# Altium schematic sheet RS232.SchDoc
size 297 x 209 mm; SheetNumber: 3; SheetTotal: 12
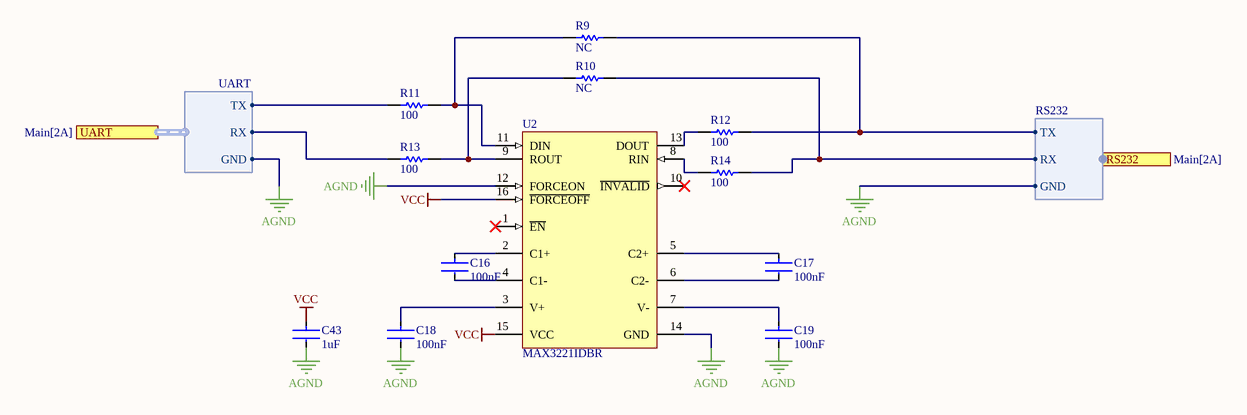
[diagram p0: RS232.SchDoc]

## Parts
C16  100nF  [CAP-0603]
C17  100nF  [CAP-0603]
C18  100nF  [CAP-0603]
C19  100nF  [CAP-0603]
C43  1uF  [CAP-0603]
R9  NC  [RES-0603]
R10  NC  [RES-0603]
R11  100  [RES-0603]
R12  100  [RES-0603]
R13  100  [RES-0603]
R14  100  [RES-0603]
U2  MAX3221IDBR  [DB0016A_M]

## Ports
RS232 (harness RS232, see Main[2A]), UART (harness UART, see Main[2A])

## Harnesses
UART: TX, RX, GND
RS232: TX, RX, GND

## Nets
AGND: C18.2 C19.2 C43.2 U2.12(FORCEON) U2.14(GND) ; port UART.GND, port RS232.GND
VCC: C43.1 U2.15(VCC) U2.16(~{FORCEOFF})
NetC16_1: C16.1 U2.2(C1+)
NetC16_2: C16.2 U2.4(C1-)
NetC17_1: C17.1 U2.5(C2+)
NetC17_2: C17.2 U2.6(C2-)
NetC18_1: C18.1 U2.3(V+)
NetC19_1: C19.1 U2.7(V-)
NetR9_1: R9.1 R11.2 U2.11(DIN)
NetR9_2: R9.2 R12.2 ; port RS232.TX
NetR10_1: R10.1 R13.2 U2.9(ROUT)
NetR10_2: R10.2 R14.2 ; port RS232.RX
NetR11_1: R11.1 ; port UART.TX
NetR12_1: R12.1 U2.13(DOUT)
NetR13_1: R13.1 ; port UART.RX
NetR14_1: R14.1 U2.8(RIN)

Not connected (* = marked no-connect by the designer): U2 1(~{EN})* 10(~{INVALID})*

## Notes on the sheet
- Title
- Size:
- Date:
- A4
- Variant :
- Time:
- Sheet
- Revision:
- of
- Company Link :
- Designer:
- Designer Link:
- www.fatehscan.com
- File:

## Library data of the parts
C16-C19 = CAP-Ceramic: Chip Multilayer Ceramic Capacitors for General Purpose, 0603; Voltage Rating (DC): 6.3V; Dielectric: X5R; Tolerance: 20%; Packaging: Tape and Reel; Width: 0.031inch; Termination: SMD/SMT; Package Quantity: 4000; Voltage Rating: 6.3V; Capacitance: 100nF; Case/Package: 0603; Min Operating Temperature: -55°C; Voltage: 6.3V; Length: 1.6mm; Thickness: 0.035inch; Lead Free: Lead Free; Depth: 0.8mm; Case Code (Imperial): 0603; Max Operating Temperature: 85°C; Material: Ceramic; Height: 0.8mm; Mount: Surface Mount; REACH SVHC: No SVHC; Radiation Hardening: No; Case Code (Metric): 1608
C43 = CAP-Ceramic: Chip Multilayer Ceramic Capacitors for General Purpose, 0603; Voltage Rating (DC): 6.3V; Dielectric: X5R; Capacitance: 100nF; Tolerance: 20%; Packaging: Tape and Reel; Width: 0.031inch; Termination: SMD/SMT; Package Quantity: 4000; Voltage Rating: 6.3V; Case/Package: 0603; Min Operating Temperature: -55°C; Voltage: 6.3V; Length: 1.6mm; Thickness: 0.035inch; Lead Free: Lead Free; Depth: 0.8mm; Case Code (Imperial): 0603; Max Operating Temperature: 85°C; Material: Ceramic; Height: 0.8mm; Mount: Surface Mount; REACH SVHC: No SVHC; Radiation Hardening: No; Case Code (Metric): 1608
R9-R14 = RES_SMD: Chip Resistor; Manufacturer: Vishay Semiconductor; Voltage Rating: 75 V; Min Operating Temperature: -55 degC; ComponentLink1URL: http://www.vishay.com/; ComponentLink1Description: Manufacturer URL; PackageReference: =Footprints; Packaging: Tape and Reel; Max Operating Temperature: 155 degC; Mount: Surface Mount; ComponentLink2Description: Datasheet; PackageDescription: 2-Pin Surface Mount Device, Body 1.575 x 0.85 mm; Length: 1.55 mm; ComponentLink2URL: http://www.vishay.com/docs/20035/dcrcwe3.pdf; Pins: 2; RoHSCompliant: true
  R9 R10: value: NC
  R11-R14: value: 100
U2 = CMP-0299-01333-2: 3-V to 5.5-V Single-Channel RS-232 Line Driver / Receiver with ±15-kV ESD Protection, -40 to 85 degC, 16-Pin SSOP (DB), Green (RoHS & no Sb/Br); RS-232: TRUE; Supply Voltage(s)(V): 3.3 or 5.0; ESD HBM(kV): +/-15; Drivers Per Package: 1; ComponentLink2Description: Datasheet; PackageDescription: 16-Pin Plastic Small Outline Package, 6.2 x 5.3 mm Body, 0.65 mm Pitch; PackageVersion: revE, Dec-2001; ComponentLink1Description: Manufacturer URL; DatasheetVersion: SLLS348M; PackageReference: DB0016A; ComponentLink3URL: http://www.ti.com/litv/pdf/msso002e; ICC(Max)(mA): 1; SubFamily: RS-232; ComponentLink1URL: www.ti.com; ComponentLink3Description: Package Specification; Single Supply: TRUE; Receivers Per Package: 1; ComponentLink2URL: http://www.ti.com/general/docs/lit/getliterature.tsp?genericPartNumber=MAX3221&fileType=pdf